# EAGLE design Cabin (EAGLE 9.0.1)
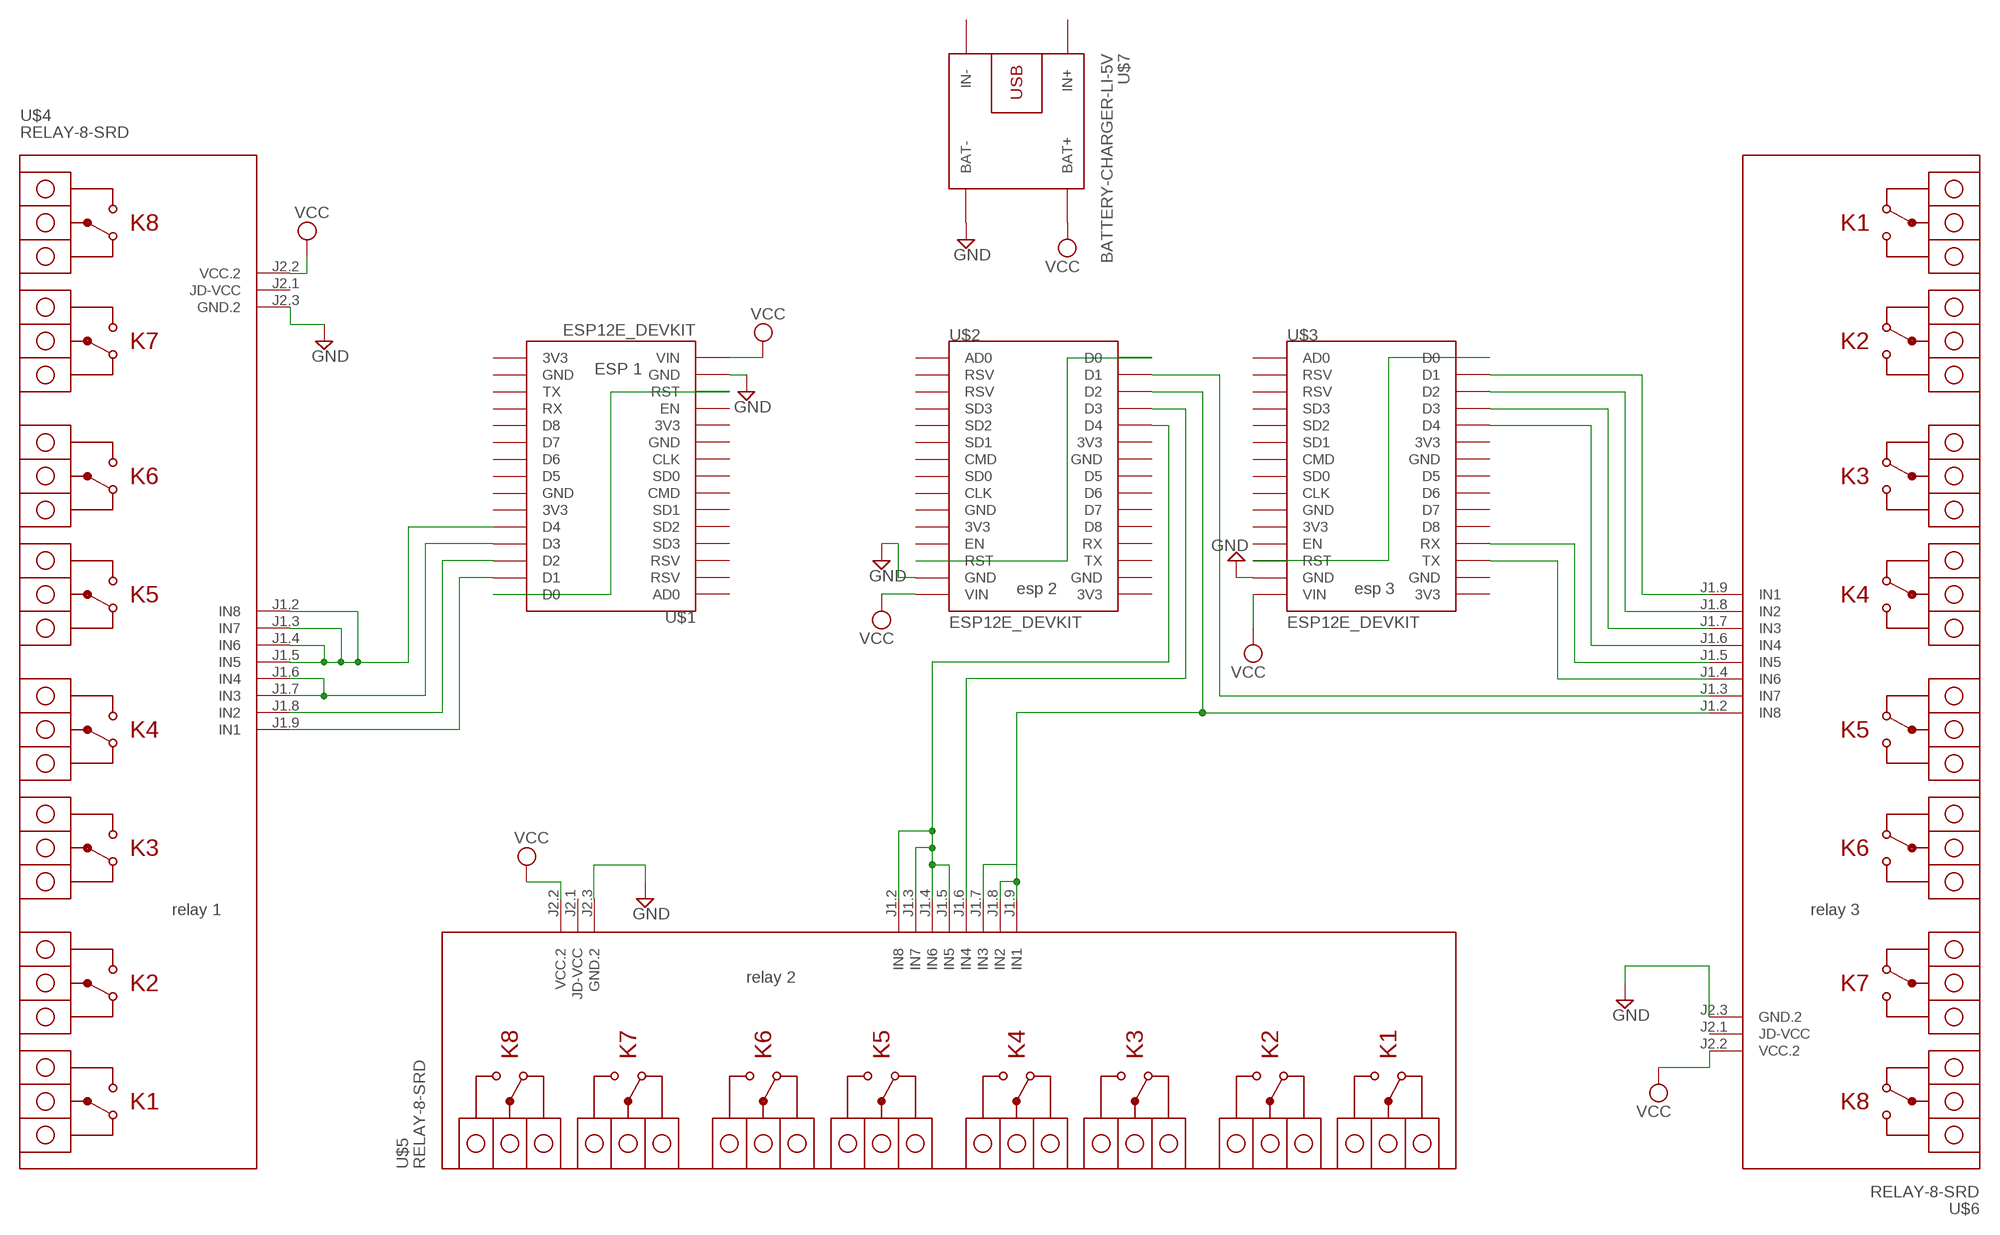
[diagram p0: schematic, sheet 1]

## Parts
U$1  ESP12E_DEVKIT  [ESP12E_DEVKIT]
U$2  ESP12E_DEVKIT  [ESP12E_DEVKIT]
U$3  ESP12E_DEVKIT  [ESP12E_DEVKIT]
U$4  RELAY-8-SRD  [RELAY-8-SRD]
U$5  RELAY-8-SRD  [RELAY-8-SRD]
U$6  RELAY-8-SRD  [RELAY-8-SRD]
U$7  BATTERY-CHARGER-LI-5V  [BATTERY-CHARGER-LI-5V]

## Nets
GND: U$1.GND@1(GND) U$2.GND@1(GND) U$3.GND@1(GND) U$4.J2.3(GND.2) U$5.J2.3(GND.2) U$6.J2.3(GND.2) U$7.BAT-
N$3: U$2.D0 U$2.RST
N$4: U$1.D0 U$1.RST
N$5: U$2.D1 U$6.J1.3(IN7)
N$6: U$3.D0 U$3.RST
N$7: U$1.D1 U$4.J1.9(IN1)
N$8: U$1.D2 U$4.J1.8(IN2)
N$9: U$1.D3 U$4.J1.6(IN4) U$4.J1.7(IN3)
N$10: U$1.D4 U$4.J1.2(IN8) U$4.J1.3(IN7) U$4.J1.4(IN6) U$4.J1.5(IN5)
N$11: U$3.D1 U$6.J1.9(IN1)
N$12: U$3.D2 U$6.J1.8(IN2)
N$13: U$3.D3 U$6.J1.7(IN3)
N$14: U$3.D4 U$6.J1.6(IN4)
N$15: U$3.RX U$6.J1.5(IN5)
N$16: U$3.TX U$6.J1.4(IN6)
N$17: U$2.D2 U$5.J1.7(IN3) U$5.J1.8(IN2) U$5.J1.9(IN1) U$6.J1.2(IN8)
N$18: U$2.D3 U$5.J1.6(IN4)
N$19: U$2.D4 U$5.J1.2(IN8) U$5.J1.3(IN7) U$5.J1.4(IN6) U$5.J1.5(IN5)
VCC: U$1.VIN U$2.VIN U$3.VIN U$4.J2.2(VCC.2) U$5.J2.2(VCC.2) U$6.J2.2(VCC.2) U$7.BAT+
Unconnected: U$1.3V3@0(3V3) U$1.3V3@1(3V3) U$1.3V3@2(3V3) U$1.AD0 U$1.CLK U$1.CMD U$1.D5 U$1.D6 U$1.D7 U$1.D8 U$1.EN U$1.GND@0(GND) U$1.GND@2(GND) U$1.GND@3(GND) U$1.RSV@0(RSV) U$1.RSV@1(RSV) U$1.RX U$1.SD0 U$1.SD1 U$1.SD2 U$1.SD3 U$1.TX U$2.3V3@0(3V3) U$2.3V3@1(3V3) U$2.3V3@2(3V3) U$2.AD0 U$2.CLK U$2.CMD U$2.D5 U$2.D6 U$2.D7 U$2.D8 U$2.EN U$2.GND@0(GND) U$2.GND@2(GND) U$2.GND@3(GND) U$2.RSV@0(RSV) U$2.RSV@1(RSV) U$2.RX U$2.SD0 U$2.SD1 U$2.SD2 U$2.SD3 U$2.TX U$3.3V3@0(3V3) U$3.3V3@1(3V3) U$3.3V3@2(3V3) U$3.AD0 U$3.CLK U$3.CMD U$3.D5 U$3.D6 U$3.D7 U$3.D8 U$3.EN U$3.GND@0(GND) U$3.GND@2(GND) U$3.GND@3(GND) U$3.RSV@0(RSV) U$3.RSV@1(RSV) U$3.SD0 U$3.SD1 U$3.SD2 U$3.SD3 U$4.J2.1(JD-VCC) U$5.J2.1(JD-VCC) U$6.J2.1(JD-VCC) U$7.IN+ U$7.IN-

## Notes on the sheet
- ESP 1
- esp 2 | esp 3
- relay 1 | relay 3
- relay 2

## Library data of the parts
U$1-U$3 = esp8266:ESP12E_DEVKIT: ESP12E DEVKIT BOARD
U$4-U$6 = diy-modules:RELAY-8-SRD: 8-Channel Relay Module based on SRD-05VDC-SL-C relays Click here to find device on ebay.com <http://www.ebay.com/sch/eight+channel+relay+module+optocoupler+5v>
U$7 = diy-modules:BATTERY-CHARGER-LI-5V: Lithium Battery 5V Charger More details available here: http://www.buildcircuit.com/how-to-use-micro-usb-5v-1a-lithium-battery-charging-board-charger-module/ Click here to find device on ebay.com <http://www.ebay.com/sch/tp4056+charger+usb>

## Board
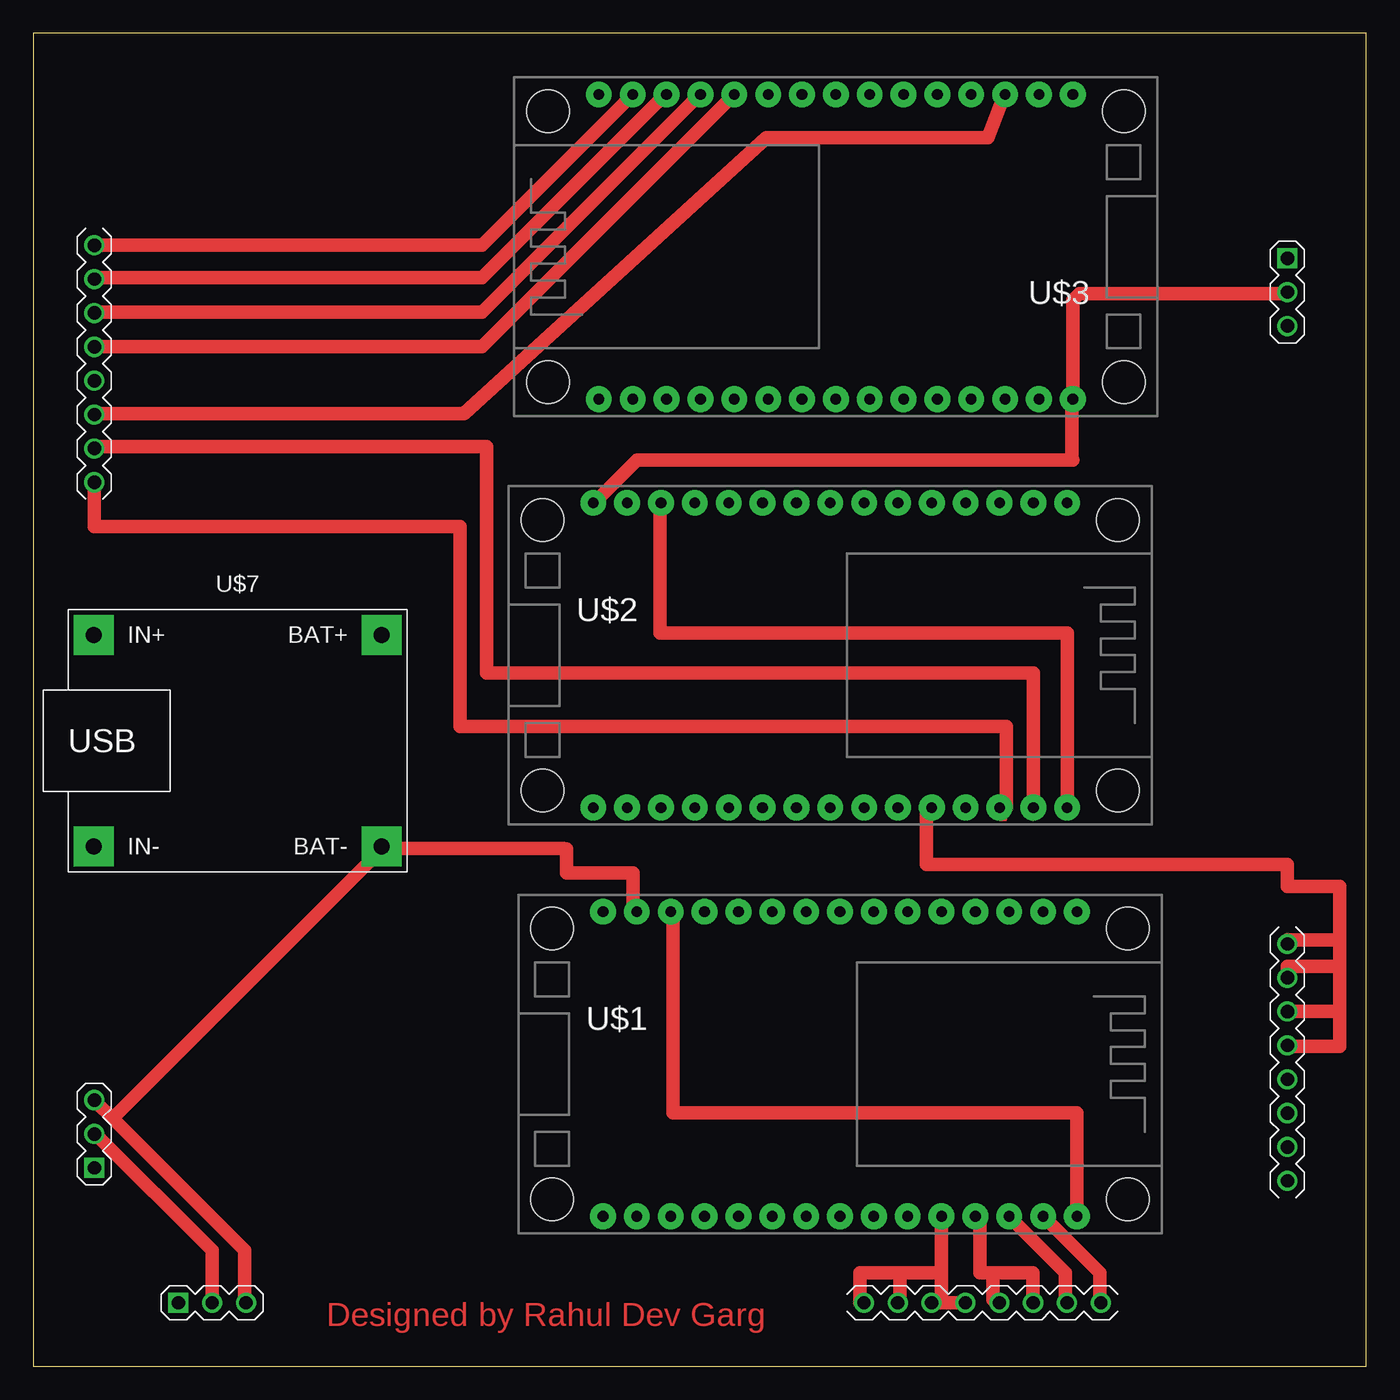
[diagram p1: board, top side]
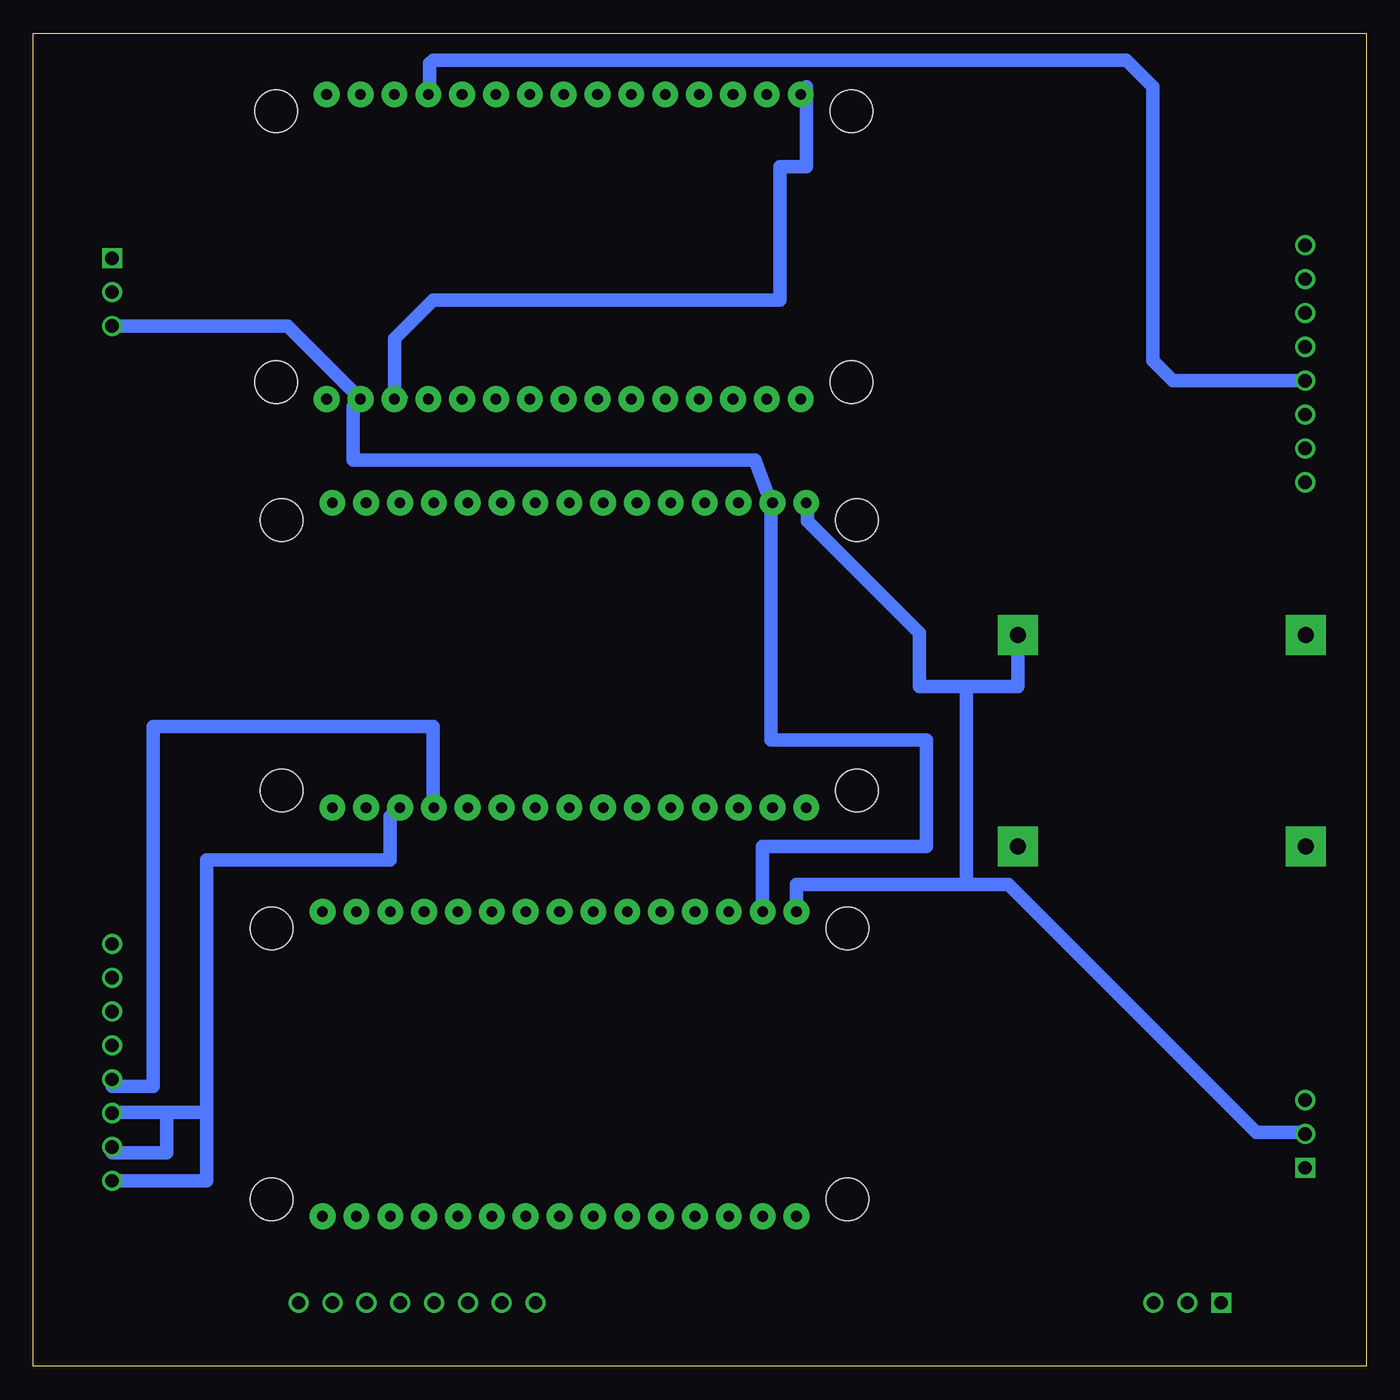
[diagram p2: board, bottom side, seen from below]

Size 100 x 100 mm. Coordinates in mm from the lower left corner, seen from the top.
Outline: 0,0 100,0 100,100 0,100 0,0
Copper layers (1*16): Top 0.035mm / dielectric 1.5mm / Bottom 0.035mm
Design rules "default": minimum track width 6mil, minimum drill 0.35mm, track to track 6mil, track to pad 6mil, pad to pad 6mil, via to via 6mil, smd to smd 6mil, copper to edge 40mil, drill to drill 6mil, minimum pad ring 10mil, minimum via ring 8mil, stop-mask expansion 4mil, vias tented up to drill 0mil, thermal gap 10mil

### Footprints (pad centres in the part's own frame; a part is rotated, then mirrored left to right if it is on the bottom)
ESP12E_DEVKIT = drill 0.8 pad 1.93: 3V3@0 -11.43,-7.62; 3V3@1 11.43,5.08; 3V3@2 11.43,-17.78; AD0 -11.43,17.78; CLK -11.43,-2.54; CMD -11.43,2.54; D0 11.43,17.78; D1 11.43,15.24; D2 11.43,12.7; D3 11.43,10.16; D4 11.43,7.62; D5 11.43,0; D6 11.43,-2.54; D7 11.43,-5.08; D8 11.43,-7.62; EN -11.43,-10.16; GND@0 -11.43,-5.08; GND@1 -11.43,-15.24; GND@2 11.43,2.54; GND@3 11.43,-15.24; RST -11.43,-12.7; RSV@0 -11.43,15.24; RSV@1 -11.43,12.7; RX 11.43,-10.16; SD0 -11.43,0; SD1 -11.43,5.08; SD2 -11.43,7.62; SD3 -11.43,10.16; TX 11.43,-12.7; VIN -11.43,-17.78 | hole 3.2: -10.16,21.59; 10.16,21.59; 10.16,-21.59; -10.16,-21.59
RELAY-8-SRD = drill 1: J1.2 24.13,5.715; J1.3 24.13,3.175; J1.4 24.13,0.635; J1.5 24.13,-1.905; J1.6 24.13,-4.445; J1.7 24.13,-6.985; J1.8 24.13,-9.525; J1.9 24.13,-12.065; J2.2 24.13,54.61; J2.3 24.13,52.07 | drill 1 square: J2.1 24.13,57.15
BATTERY-CHARGER-LI-5V = drill 1.2 pad 3 square: BAT+ 10.795,8.255; BAT- 10.795,-7.62; IN+ -10.795,8.255; IN- -10.795,-7.62

### Placement (x,y rotation side)
U$1  60.52,22.67 270 top
U$2  59.79,53.34 270 top
U$3  60.21,83.99 90 top
U$4  68.03,-19.37 90 top
U$5  69.96,25.97 0 top
U$6  28.71,72.03 180 top
U$7  15.33,46.62 0 top

### Tracks (layer width: path | path; a pad name or v marks a point on that pad's centre or on a via)
GND
  Top 0.152: 15.85,4.88 U$4.J2.3 | 39.78,38.86 39.82,38.82 40,38.82 | 45.26,34.14 45.27,34.12 U$1.GND@1
  Top 1: 15.85,4.88 15.85,8.69 5.94,18.59 | 5.94,18.59 4.72,19.81 U$6.J2.3 | 26.21,38.86 39.78,38.86 | 26.21,38.86 5.94,18.59 | 26.21,38.86 U$7.BAT- | 40,38.82 40,37 45,37 45,34.12 45.27,34.12
  Bottom 0.152: 94.03,78.03 U$5.J2.3 | 75.59,72.69 U$3.GND@1 75.44,72.54 76,71.98 | 44.65,64.77 U$2.GND@1 | 68.12,67.99 68.13,68
  Bottom 1: 94.03,78.03 80.92,78.03 75.59,72.69 | 68.12,67.99 45.87,67.99 44.65,64.77 44.65,47 33,47 33,39 45.28,39 U$1.GND@1 | 68.13,68 76,68 76,71.98
N$3
  Top 0.152: U$2.RST 47,64.77
  Top 1: U$2.D0 77.57,55 47,55 47,64.77
N$4
  Top 1: U$1.D0 78.3,19 48,19 48,34.1 U$1.RST
N$5
  Top 0.152: 5,68.86 5,69 4.57,68.89 U$6.J1.3 | 75,41 75.03,41 U$2.D1
  Top 1: U$2.D1 75.03,52 34,52 34,69 5,69
N$6
  Bottom 0.152: 71.93,72.69 72.85,72.69 U$3.RST | U$3.D0 42.37,95.4 42,95.4
  Bottom 1: U$3.RST 72.91,77.09 70,80 44,80 44,90 42,90 42,95.4 42,96
N$7
  Top 1: U$4.J1.9 80.01,4.88 80.01,7.01 75.89,11.12 U$1.D1
N$8
  Top 1: U$4.J1.8 77.42,4.88 77.42,7.01 73.3,11.12 U$1.D2
N$9
  Top 0.152: U$4.J1.7 75.13,4.72 75,5
  Top 1: U$1.D3 71,11.24 71,7 72,7 | 72,7 75,7 75,5 | 72,7 72,5 72.47,5 U$4.J1.6
N$10
  Top 0.152: 68.14,4.76 U$4.J1.4
  Top 1: U$1.D4 68.14,7 | 68.14,7 65,7 | 65,7 62,7 62,4.76 U$4.J1.2 | 65,7 65,4.76 U$4.J1.3 | 68.14,7 68.14,4.76 | U$4.J1.4 U$4.J1.5
N$11
  Top 0.152: 4.72,84.12 U$6.J1.9 | 44.96,95.4 U$3.D1
  Top 1: 4.72,84.12 33.68,84.12 44.96,95.4
N$12
  Top 0.152: 4.72,81.69 U$6.J1.8 | 47.4,95.4 U$3.D2
  Top 1: 4.72,81.69 33.68,81.69 47.4,95.4
N$13
  Top 0.152: 4.72,79.1 U$6.J1.7 | 49.99,95.4 U$3.D3
  Top 1: 4.72,79.1 33.68,79.1 49.99,95.4
N$14
  Top 0.152: 4.72,76.5 U$6.J1.6 | 52.58,95.4 U$3.D4
  Top 1: 4.72,76.5 33.68,76.5 52.58,95.4
N$15
  Bottom 0.152: 70.26,95.56 U$3.RX | 70,98 70.26,97.74 | 14.5,73.94 14.63,74.07
  Bottom 1: 14.63,74.07 16,75.44 16,96 18,98 70,98 | 70.26,97.74 70.26,95.56 | U$6.J1.5 14.5,73.94
N$16
  Top 0.152: 4.72,71.48 U$6.J1.4 | 72.85,95.4 U$3.TX
  Top 1: 4.72,71.48 32.31,71.48 55.02,92.18 71.63,92.18 72.85,95.4
N$17
  Top 0.152: U$2.D2 72.49,41 73,41 73,41.91
  Top 1: U$6.J1.2 4.58,63 32,63 32,48 73,48 73,41.91
  Bottom 0.152: 73.23,41.23 72.54,41.91 U$2.D2 | U$5.J1.7 94.03,19.05 | 89,19.05 89,19 90,19
  Bottom 1: 87,19.05 87,38 73.23,38 73.23,41.23 | 94.03,19.05 89,19.05 87,19.05 | U$5.J1.9 87,13.9 87,19.05 | 90,19 90,16 94.09,16 U$5.J1.8
N$18
  Bottom 0.152: 70,41.91 U$2.D3
  Bottom 1: 70,41.91 70,48 91,48 91,21 94.09,21 U$5.J1.6
N$19
  Top 0.152: 94,24 94.09,24 U$5.J1.5
  Top 1: 98,32 98,36 94.07,36 94.07,37.66 67,37.66 67,41.91 U$2.D4 | 98,30 98,32 | 98,26.61 98,30 | 98,26.61 98,24 94.09,24 | 98,26.61 U$5.J1.4 | 98,30 94.09,30 U$5.J1.3 | 98,32 94.09,32 U$5.J1.2
VCC
  Top 0.152: 94.03,80.47 U$5.J2.2 | 78.03,72.69 U$3.VIN | 77.88,72.54 77.92,72.55 U$3.VIN | 42.06,64.77 U$2.VIN | U$3.VIN | 78,68 77.92,68.08
  Top 1: 94.03,80.47 78.47,80.47 78,80 U$3.VIN | U$4.J2.2 13.41,4.88 13.41,8.69 4.72,17.37 U$6.J2.2 | 42.06,64.77 45.29,68 78,68 | 77.92,68.08 77.92,72.55
  Bottom 0.152: 41.91,64.77 U$2.VIN
  Bottom 1: 41.91,64.77 41.91,63.4 33.53,55.02 33.53,51 30,51 | U$6.J2.2 4.72,17.53 8.23,17.53 26.85,36.15 30,36.15 | 30,36.15 42.74,36.15 U$1.VIN | 30,51 30,36.15 | U$7.BAT+ 26.12,51 30,51

### Text on the board
Top: Designed by Rahul Dev Garg